# EAGLE design protoboard.rev01 (EAGLE 9.6.2)
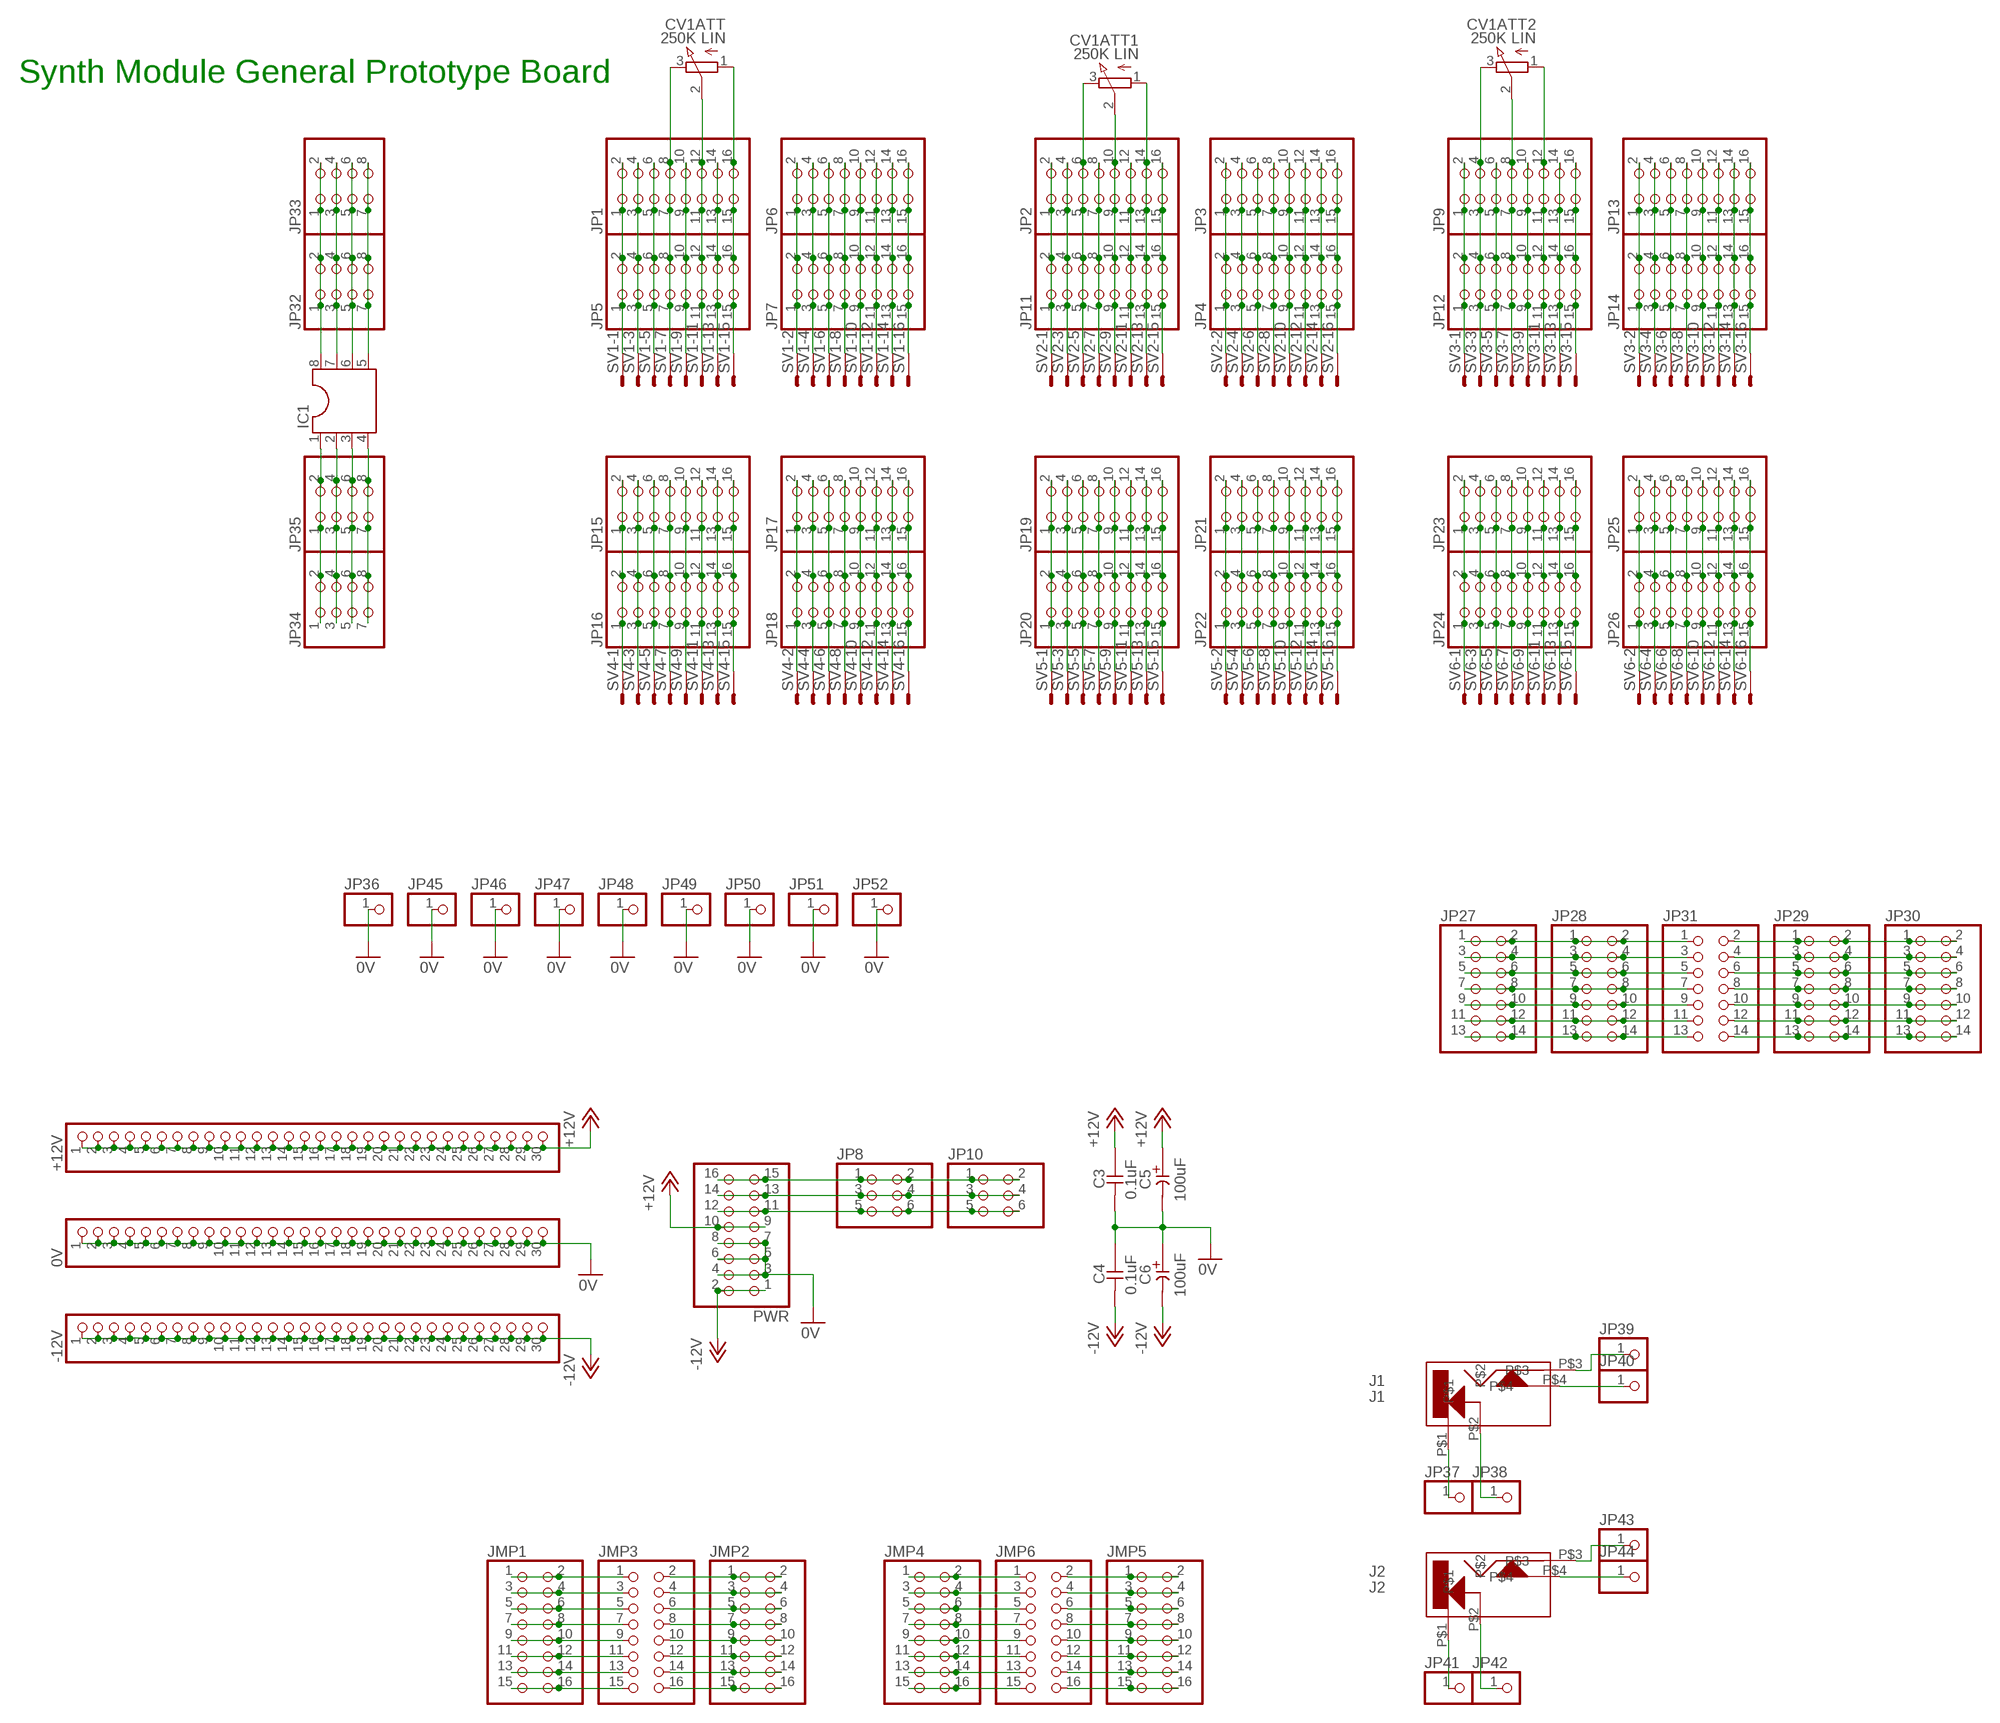
[diagram p0: schematic, sheet 1]

## Parts
0V  PINHD-1X30  [1X30]
+12V  PINHD-1X30  [1X30]
-12V  PINHD-1X30  [1X30]
C3  0.1uF  CC-US025-024X044  [C025-024X044]
C4  0.1uF  CC-US025-024X044  [C025-024X044]
C5  100uF  CE-USE5-8.5  [E5-8,5]
C6  100uF  CE-USE5-8.5  [E5-8,5]
CV1ATT  250K LIN  3RP/1610N  [3RP/1610N]
CV1ATT1  250K LIN  3RP/1610N  [3RP/1610N]
CV1ATT2  250K LIN  3RP/1610N  [3RP/1610N]
IC1  DIL8S  [SOCKET-08]
J1  J1  CL1384  [CL1384]
J2  J2  CL1384  [CL1384]
JMP1  PINHD-2X8  [2X08]
JMP2  PINHD-2X8  [2X08]
JMP3  PINHD-2X8  [2X08]
JMP4  PINHD-2X8  [2X08]
JMP5  PINHD-2X8  [2X08]
JMP6  PINHD-2X8  [2X08]
JP1  PINHD-2X8  [2X08]
JP2  PINHD-2X8  [2X08]
JP3  PINHD-2X8  [2X08]
JP4  PINHD-2X8  [2X08]
JP5  PINHD-2X8  [2X08]
JP6  PINHD-2X8  [2X08]
JP7  PINHD-2X8  [2X08]
JP8  PINHD-2X3  [2X03]
JP9  PINHD-2X8  [2X08]
JP10  PINHD-2X3  [2X03]
JP11  PINHD-2X8  [2X08]
JP12  PINHD-2X8  [2X08]
JP13  PINHD-2X8  [2X08]
JP14  PINHD-2X8  [2X08]
JP15  PINHD-2X8  [2X08]
JP16  PINHD-2X8  [2X08]
JP17  PINHD-2X8  [2X08]
JP18  PINHD-2X8  [2X08]
JP19  PINHD-2X8  [2X08]
JP20  PINHD-2X8  [2X08]
JP21  PINHD-2X8  [2X08]
JP22  PINHD-2X8  [2X08]
JP23  PINHD-2X8  [2X08]
JP24  PINHD-2X8  [2X08]
JP25  PINHD-2X8  [2X08]
JP26  PINHD-2X8  [2X08]
JP27  PINHD-2X7  [2X07]
JP28  PINHD-2X7  [2X07]
JP29  PINHD-2X7  [2X07]
JP30  PINHD-2X7  [2X07]
JP31  PINHD-2X7  [2X07]
JP32  PINHD-2X4  [2X04]
JP33  PINHD-2X4  [2X04]
JP34  PINHD-2X4  [2X04]
JP35  PINHD-2X4  [2X04]
JP36  PINHD-1X1  [1X01]
JP37  PINHD-1X1  [1X01]
JP38  PINHD-1X1  [1X01]
JP39  PINHD-1X1  [1X01]
JP40  PINHD-1X1  [1X01]
JP41  PINHD-1X1  [1X01]
JP42  PINHD-1X1  [1X01]
JP43  PINHD-1X1  [1X01]
JP44  PINHD-1X1  [1X01]
JP45  PINHD-1X1  [1X01]
JP46  PINHD-1X1  [1X01]
JP47  PINHD-1X1  [1X01]
JP48  PINHD-1X1  [1X01]
JP49  PINHD-1X1  [1X01]
JP50  PINHD-1X1  [1X01]
JP51  PINHD-1X1  [1X01]
JP52  PINHD-1X1  [1X01]
PWR  PINHD-2X8  [2X08]
SV1  16E  [16P]
SV2  16E  [16P]
SV3  16E  [16P]
SV4  16E  [16P]
SV5  16E  [16P]
SV6  16E  [16P]

## Nets
0V [pwr]: 0V.1 0V.2 0V.3 0V.4 0V.5 0V.6 0V.7 0V.8 0V.9 0V.10 0V.11 0V.12 0V.13 0V.14 0V.15 0V.16 0V.17 0V.18 0V.19 0V.20 0V.21 0V.22 0V.23 0V.24 0V.25 0V.26 0V.27 0V.28 0V.29 0V.30 C3.2 C4.1 C5.- C6.+ JP36.1 JP45.1 JP46.1 JP47.1 JP48.1 JP49.1 JP50.1 JP51.1 JP52.1 PWR.3 PWR.4 PWR.5 PWR.6 PWR.7 PWR.8
+12V [pwr]: +12V.1 +12V.2 +12V.3 +12V.4 +12V.5 +12V.6 +12V.7 +12V.8 +12V.9 +12V.10 +12V.11 +12V.12 +12V.13 +12V.14 +12V.15 +12V.16 +12V.17 +12V.18 +12V.19 +12V.20 +12V.21 +12V.22 +12V.23 +12V.24 +12V.25 +12V.26 +12V.27 +12V.28 +12V.29 +12V.30 C3.1 C5.+ PWR.9 PWR.10
-12V [pwr]: -12V.1 -12V.2 -12V.3 -12V.4 -12V.5 -12V.6 -12V.7 -12V.8 -12V.9 -12V.10 -12V.11 -12V.12 -12V.13 -12V.14 -12V.15 -12V.16 -12V.17 -12V.18 -12V.19 -12V.20 -12V.21 -12V.22 -12V.23 -12V.24 -12V.25 -12V.26 -12V.27 -12V.28 -12V.29 -12V.30 C4.2 C6.- PWR.1 PWR.2
N$1: JP2.1 JP2.2 JP11.1 JP11.2 SV2.1
N$2: JP3.1 JP3.2 JP4.1 JP4.2 SV2.2
N$3: JP2.3 JP2.4 JP11.3 JP11.4 SV2.3
N$4: CV1ATT1.3(E) JP2.5 JP2.6 JP11.5 JP11.6 SV2.5
N$5: JP2.7 JP2.8 JP11.7 JP11.8 SV2.7
N$6: CV1ATT1.2(S) JP2.9 JP2.10 JP11.9 JP11.10 SV2.9
N$7: JP2.11 JP2.12 JP11.11 JP11.12 SV2.11
N$8: CV1ATT1.1(A) JP2.13 JP2.14 JP11.13 JP11.14 SV2.13
N$9: JP3.3 JP3.4 JP4.3 JP4.4 SV2.4
N$10: JP3.5 JP3.6 JP4.5 JP4.6 SV2.6
N$11: JP3.7 JP3.8 JP4.7 JP4.8 SV2.8
N$12: JP3.9 JP3.10 JP4.9 JP4.10 SV2.10
N$13: JP3.11 JP3.12 JP4.11 JP4.12 SV2.12
N$14: JP3.13 JP3.14 JP4.13 JP4.14 SV2.14
N$15: JP3.15 JP3.16 JP4.15 JP4.16 SV2.16
N$16: JP1.1 JP1.2 JP5.1 JP5.2 SV1.1
N$17: JP1.3 JP1.4 JP5.3 JP5.4 SV1.3
N$18: JP1.5 JP1.6 JP5.5 JP5.6 SV1.5
N$19: CV1ATT.3(E) JP1.7 JP1.8 JP5.7 JP5.8 SV1.7
N$20: JP1.9 JP1.10 JP5.9 JP5.10 SV1.9
N$24: CV1ATT.2(S) JP1.11 JP1.12 JP5.11 JP5.12 SV1.11
N$25: JP1.13 JP1.14 JP5.13 JP5.14 SV1.13
N$26: CV1ATT.1(A) JP1.15 JP1.16 JP5.15 JP5.16 SV1.15
N$27: JP6.1 JP6.2 JP7.1 JP7.2 SV1.2
N$28: JP6.3 JP6.4 JP7.3 JP7.4 SV1.4
N$29: JP6.5 JP6.6 JP7.5 JP7.6 SV1.6
N$30: JP6.7 JP6.8 JP7.7 JP7.8 SV1.8
N$31: JP6.9 JP6.10 JP7.9 JP7.10 SV1.10
N$32: JP6.11 JP6.12 JP7.11 JP7.12 SV1.12
N$33: JP2.15 JP2.16 JP11.15 JP11.16 SV2.15
N$34: JP6.13 JP6.14 JP7.13 JP7.14 SV1.14
N$35: JP6.15 JP6.16 JP7.15 JP7.16 SV1.16
N$36: JP9.1 JP9.2 JP12.1 JP12.2 SV3.1
N$37: CV1ATT2.3(E) JP9.3 JP9.4 JP12.3 JP12.4 SV3.3
N$38: JP9.5 JP9.6 JP12.5 JP12.6 SV3.5
N$39: CV1ATT2.2(S) JP9.7 JP9.8 JP12.7 JP12.8 SV3.7
N$40: JP9.9 JP9.10 JP12.9 JP12.10 SV3.9
N$41: CV1ATT2.1(A) JP9.11 JP9.12 JP12.11 JP12.12 SV3.11
N$42: JP9.13 JP9.14 JP12.13 JP12.14 SV3.13
N$43: JP9.15 JP9.16 JP12.15 JP12.16 SV3.15
N$44: JP13.1 JP13.2 JP14.1 JP14.2 SV3.2
N$45: JP13.3 JP13.4 JP14.3 JP14.4 SV3.4
N$46: JP13.5 JP13.6 JP14.5 JP14.6 SV3.6
N$47: JP13.7 JP13.8 JP14.7 JP14.8 SV3.8
N$48: JP13.9 JP13.10 JP14.9 JP14.10 SV3.10
N$49: JP13.11 JP13.12 JP14.11 JP14.12 SV3.12
N$50: JP13.13 JP13.14 JP14.13 JP14.14 SV3.14
N$51: JP13.15 JP13.16 JP14.15 JP14.16 SV3.16
N$52: JP15.1 JP15.2 JP16.1 JP16.2 SV4.1
N$53: JP15.3 JP15.4 JP16.3 JP16.4 SV4.3
N$54: JP15.5 JP15.6 JP16.5 JP16.6 SV4.5
N$55: JP15.7 JP15.8 JP16.7 JP16.8 SV4.7
N$56: JP15.9 JP15.10 JP16.9 JP16.10 SV4.9
N$57: JP15.11 JP15.12 JP16.11 JP16.12 SV4.11
N$58: JP15.13 JP15.14 JP16.13 JP16.14 SV4.13
N$59: JP15.15 JP15.16 JP16.15 JP16.16 SV4.15
N$60: JP17.1 JP17.2 JP18.1 JP18.2 SV4.2
N$61: JP17.3 JP17.4 JP18.3 JP18.4 SV4.4
N$62: JP17.5 JP17.6 JP18.5 JP18.6 SV4.6
N$63: JP17.7 JP17.8 JP18.7 JP18.8 SV4.8
N$64: JP17.9 JP17.10 JP18.9 JP18.10 SV4.10
N$65: JP17.11 JP17.12 JP18.11 JP18.12 SV4.12
N$66: JP17.13 JP17.14 JP18.13 JP18.14 SV4.14
N$67: JP17.15 JP17.16 JP18.15 JP18.16 SV4.16
N$68: JP19.1 JP19.2 JP20.1 JP20.2 SV5.1
N$69: JP19.3 JP19.4 JP20.3 JP20.4 SV5.3
N$70: JP19.5 JP19.6 JP20.5 JP20.6 SV5.5
N$71: JP19.7 JP19.8 JP20.7 JP20.8 SV5.7
N$72: JP19.9 JP19.10 JP20.9 JP20.10 SV5.9
N$73: JP19.11 JP19.12 JP20.11 JP20.12 SV5.11
N$74: JP19.13 JP19.14 JP20.13 JP20.14 SV5.13
N$75: JP19.15 JP19.16 JP20.15 JP20.16 SV5.15
N$76: JP21.1 JP21.2 JP22.1 JP22.2 SV5.2
N$77: JP21.3 JP21.4 JP22.3 JP22.4 SV5.4
N$78: JP21.5 JP21.6 JP22.5 JP22.6 SV5.6
N$79: JP21.7 JP21.8 JP22.7 JP22.8 SV5.8
N$80: JP21.9 JP21.10 JP22.9 JP22.10 SV5.10
N$81: JP21.11 JP21.12 JP22.11 JP22.12 SV5.12
N$82: JP21.13 JP21.14 JP22.13 JP22.14 SV5.14
N$83: JP21.15 JP21.16 JP22.15 JP22.16 SV5.16
N$84: JP23.1 JP23.2 JP24.1 JP24.2 SV6.1
N$85: JP23.3 JP23.4 JP24.3 JP24.4 SV6.3
N$86: JP23.5 JP23.6 JP24.5 JP24.6 SV6.5
N$87: JP23.7 JP23.8 JP24.7 JP24.8 SV6.7
N$88: JP23.9 JP23.10 JP24.9 JP24.10 SV6.9
N$89: JP23.11 JP23.12 JP24.11 JP24.12 SV6.11
N$90: JP23.13 JP23.14 JP24.13 JP24.14 SV6.13
N$91: JP23.15 JP23.16 JP24.15 JP24.16 SV6.15
N$92: JP25.1 JP25.2 JP26.1 JP26.2 SV6.2
N$93: JP25.3 JP25.4 JP26.3 JP26.4 SV6.4
N$94: JP25.5 JP25.6 JP26.5 JP26.6 SV6.6
N$95: JP25.7 JP25.8 JP26.7 JP26.8 SV6.8
N$96: JP25.9 JP25.10 JP26.9 JP26.10 SV6.10
N$97: JP25.11 JP25.12 JP26.11 JP26.12 SV6.12
N$98: JP25.13 JP25.14 JP26.13 JP26.14 SV6.14
N$99: JP25.15 JP25.16 JP26.15 JP26.16 SV6.16
N$100: J1.P$1 JP37.1
N$101: J1.P$2 JP38.1
N$102: J2.P$1 JP41.1
N$103: J2.P$2 JP42.1
N$104: JMP1.1 JMP1.2 JMP3.1
N$105: JMP1.3 JMP1.4 JMP3.3
N$106: JMP1.5 JMP1.6 JMP3.5
N$107: JMP1.7 JMP1.8 JMP3.7
N$108: JMP1.9 JMP1.10 JMP3.9
N$109: JMP1.11 JMP1.12 JMP3.11
N$110: JMP1.13 JMP1.14 JMP3.13
N$111: JMP1.15 JMP1.16 JMP3.15
N$112: JMP2.1 JMP2.2 JMP3.2
N$113: JMP2.3 JMP2.4 JMP3.4
N$114: JMP2.5 JMP2.6 JMP3.6
N$115: JMP2.7 JMP2.8 JMP3.8
N$116: JMP2.9 JMP2.10 JMP3.10
N$117: JMP2.11 JMP2.12 JMP3.12
N$118: JMP2.13 JMP2.14 JMP3.14
N$119: JMP2.15 JMP2.16 JMP3.16
N$120: JMP4.1 JMP4.2 JMP6.1
N$121: JMP4.3 JMP4.4 JMP6.3
N$122: JMP4.5 JMP4.6 JMP6.5
N$123: JMP4.7 JMP4.8 JMP6.7
N$124: JMP4.9 JMP4.10 JMP6.9
N$125: JMP4.11 JMP4.12 JMP6.11
N$126: JMP4.13 JMP4.14 JMP6.13
N$127: JMP4.15 JMP4.16 JMP6.15
N$128: JMP5.1 JMP5.2 JMP6.2
N$129: JMP5.3 JMP5.4 JMP6.4
N$130: JMP5.5 JMP5.6 JMP6.6
N$131: JMP5.7 JMP5.8 JMP6.8
N$132: JMP5.9 JMP5.10 JMP6.10
N$133: JMP5.11 JMP5.12 JMP6.12
N$134: JMP5.13 JMP5.14 JMP6.14
N$135: JMP5.15 JMP5.16 JMP6.16
N$136: JP27.1 JP27.2 JP28.1 JP28.2 JP31.1
N$137: JP27.3 JP27.4 JP28.3 JP28.4 JP31.3
N$138: JP27.5 JP27.6 JP28.5 JP28.6 JP31.5
N$139: JP27.7 JP27.8 JP28.7 JP28.8 JP31.7
N$140: JP27.9 JP27.10 JP28.9 JP28.10 JP31.9
N$141: JP27.11 JP27.12 JP28.11 JP28.12 JP31.11
N$142: JP27.13 JP27.14 JP28.13 JP28.14 JP31.13
N$143: IC1.8 JP32.1 JP32.2 JP33.1 JP33.2
N$144: IC1.7 JP32.3 JP32.4 JP33.3 JP33.4
N$145: IC1.6 JP32.5 JP32.6 JP33.5 JP33.6
N$146: IC1.5 JP32.7 JP32.8 JP33.7 JP33.8
N$147: J2.P$3 JP43.1
N$148: J2.P$4 JP44.1
N$149: J1.P$4 JP40.1
N$150: JP29.1 JP29.2 JP30.1 JP30.2 JP31.2
N$151: JP29.3 JP29.4 JP30.3 JP30.4 JP31.4
N$152: JP29.5 JP29.6 JP30.5 JP30.6 JP31.6
N$153: JP29.7 JP29.8 JP30.7 JP30.8 JP31.8
N$154: JP29.9 JP29.10 JP30.9 JP30.10 JP31.10
N$155: JP29.11 JP29.12 JP30.11 JP30.12 JP31.12
N$156: JP29.13 JP29.14 JP30.13 JP30.14 JP31.14
N$157: J1.P$3 JP39.1
N$158: IC1.1 JP34.1 JP34.2 JP35.1 JP35.2
N$159: IC1.2 JP34.3 JP34.4 JP35.3 JP35.4
N$160: IC1.3 JP34.5 JP34.6 JP35.5 JP35.6
N$161: IC1.4 JP34.7 JP34.8 JP35.7 JP35.8
N$165: JP8.5 JP8.6 JP10.5 JP10.6 PWR.11 PWR.12
N$166: JP8.1 JP8.2 JP10.1 JP10.2 PWR.15 PWR.16
N$169: JP8.3 JP8.4 JP10.3 JP10.4 PWR.13 PWR.14

## Notes on the sheet
- Synth Module General Prototype Board

## Library data of the parts
0V +12V -12V = pinhead:PINHD-1X30: PIN HEADER
C3 C4 = _common:CC-US: CAPACITOR, US symbol
C5 C6 = _common:CE-US: ELECTROLYTIC CAPACITOR, US symbol
CV1ATT CV1ATT1 CV1ATT2 = _common:3RP/1610N: Generic single level pcb pot.
IC1 = ic-package:DIL8: Dual In Line / Socket
J1 J2 = jacks:CL1384
JMP1-JMP6 JP1-JP7 JP9 JP11-JP26 PWR = pinhead:PINHD-2X8: PIN HEADER
JP8 JP10 = pinhead:PINHD-2X3: PIN HEADER
JP27-JP31 = pinhead:PINHD-2X7: PIN HEADER
JP32-JP35 = pinhead:PINHD-2X4: PIN HEADER
JP36-JP52 = pinhead:PINHD-1X1: PIN HEADER
SV1-SV6 = con-dil:16E: DIL CABLE CONNECTOR

## Net classes
0 default: width 0.406 mm, clearance 0.305 mm
1 pwr: width 0.813 mm, clearance 0.305 mm to class 0, clearance 0.305 mm

## Board
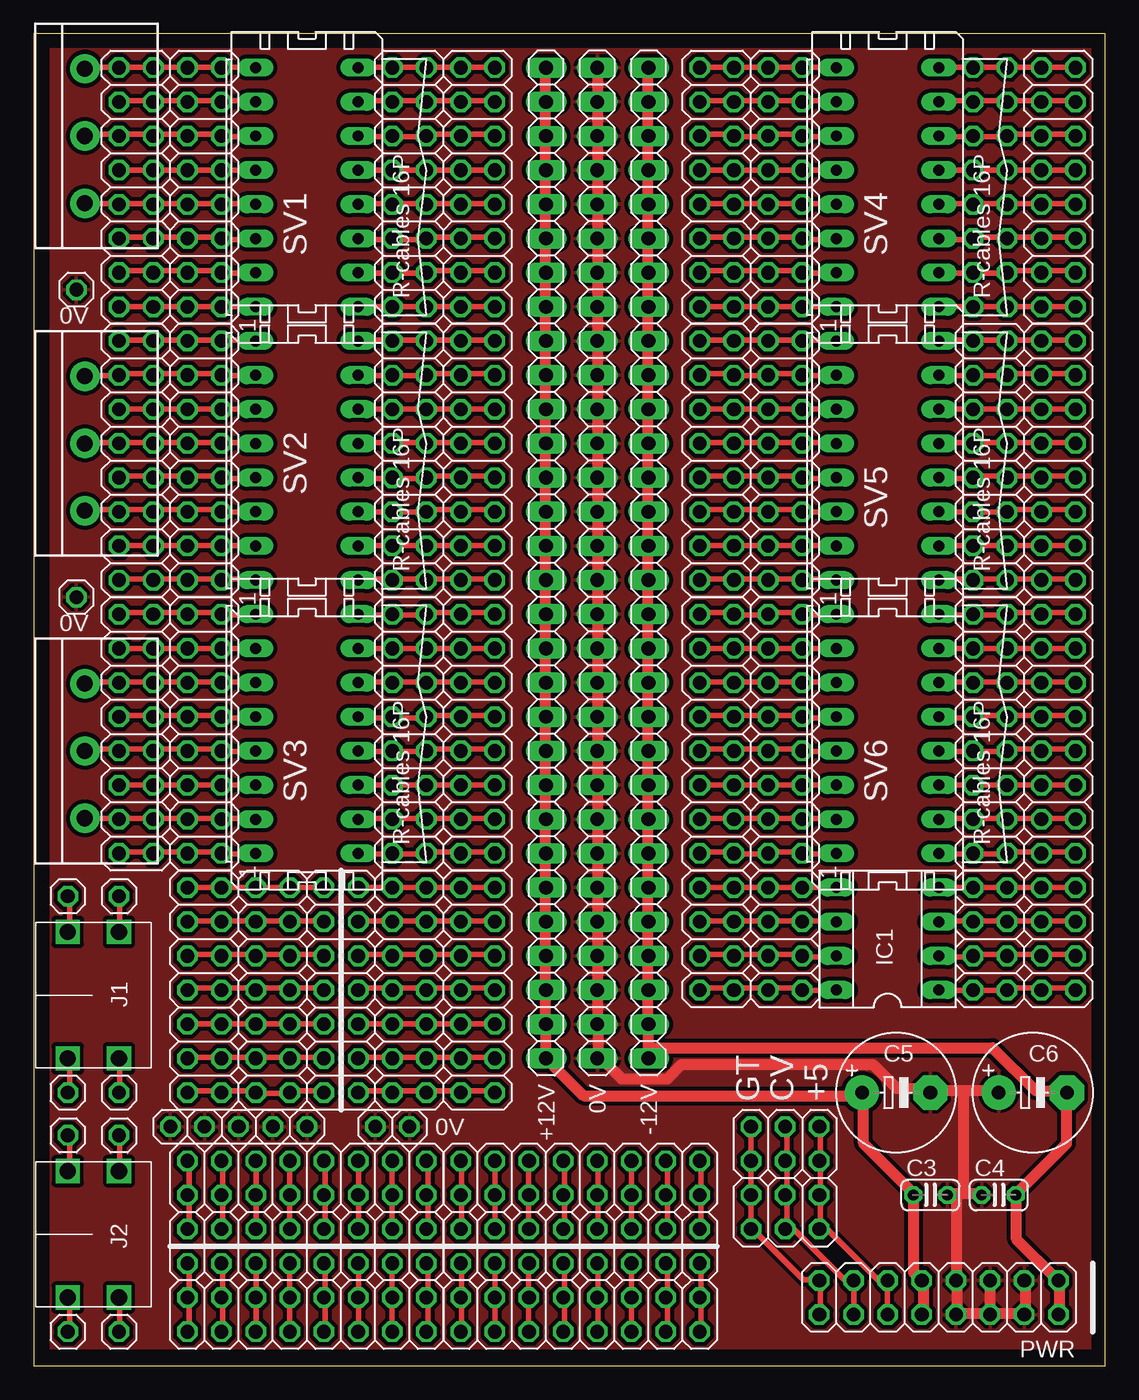
[diagram p1: board, top side]
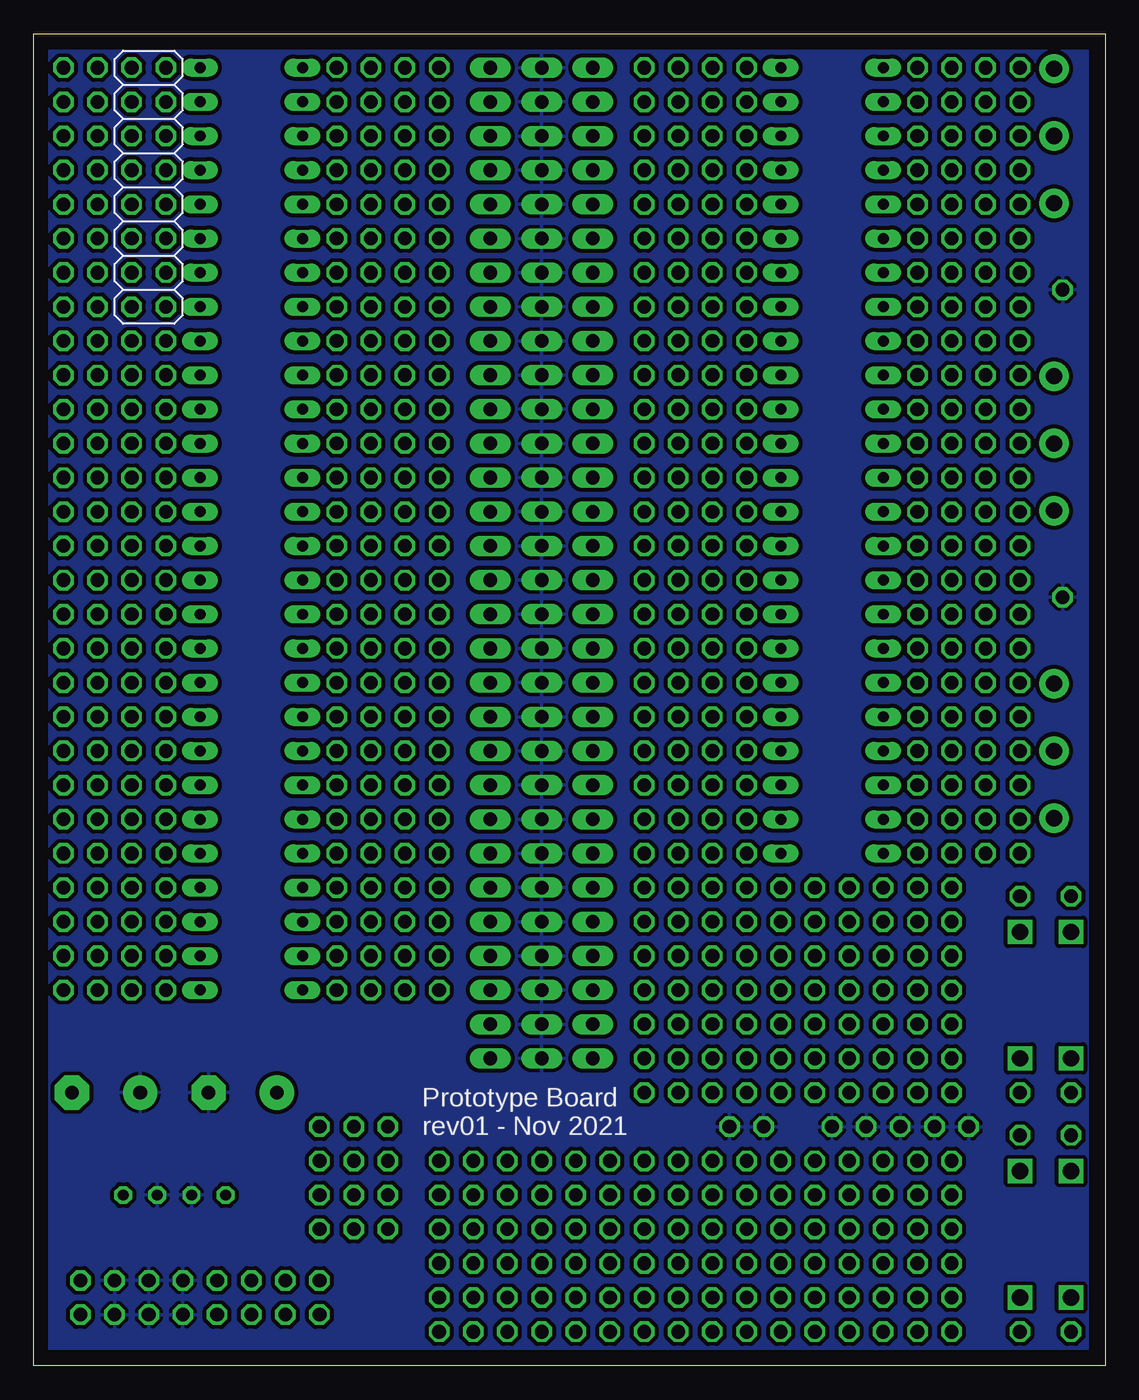
[diagram p2: board, bottom side, seen from below]

Size 79.68 x 99.05 mm. Coordinates in mm from the lower left corner, seen from the top.
Outline: 0,0 79.68,0 79.68,99.05 0,99.05 0,0
Copper layers (1*16): Top 0.035mm / dielectric 1.5mm / Bottom 0.035mm
Design rules "default": minimum track width 6mil, minimum drill 0.35mm, track to track 6mil, track to pad 6mil, pad to pad 6mil, via to via 6mil, smd to smd 6mil, copper to edge 40mil, drill to drill 6mil, minimum pad ring 10mil, minimum via ring 8mil, stop-mask expansion 4mil, vias tented up to drill 0mil, thermal gap 10mil

### Footprints (pad centres in the part's own frame; a part is rotated, then mirrored left to right if it is on the bottom)
1X30 = drill 1.016 long: 1 -36.83,0; 2 -34.29,0; 3 -31.75,0; 4 -29.21,0; 5 -26.67,0; 6 -24.13,0; 7 -21.59,0; 8 -19.05,0; 9 -16.51,0; 10 -13.97,0; 11 -11.43,0; 12 -8.89,0; 13 -6.35,0; 14 -3.81,0; 15 -1.27,0; 16 1.27,0; 17 3.81,0; 18 6.35,0; 19 8.89,0; 20 11.43,0; 21 13.97,0; 22 16.51,0; 23 19.05,0; 24 21.59,0; 25 24.13,0; 26 26.67,0; 27 29.21,0; 28 31.75,0; 29 34.29,0; 30 36.83,0
C025-024X044 = drill 0.813 octagon: 1 -1.27,0; 2 1.27,0
E5-8,5 = drill 1.016 pad 2.54: + -2.54,0 | drill 1.016 pad 2.54 octagon: - 2.54,0
3RP/1610N = drill 1.2 pad 2.184: 1 -5,0; 2 0,0; 3 5,0
SOCKET-08 = drill 0.813 long: 1 -3.81,-3.81; 2 -1.27,-3.81; 3 1.27,-3.81; 4 3.81,-3.81; 5 3.81,3.81; 6 1.27,3.81; 7 -1.27,3.81; 8 -3.81,3.81
CL1384 = drill 1.2 square: P$1 0,0; P$2 9.4,0; P$3 0,-3.8; P$4 9.4,-3.8
2X08 = drill 1.016 octagon: 1 -8.89,-1.27; 2 -8.89,1.27; 3 -6.35,-1.27; 4 -6.35,1.27; 5 -3.81,-1.27; 6 -3.81,1.27; 7 -1.27,-1.27; 8 -1.27,1.27; 9 1.27,-1.27; 10 1.27,1.27; 11 3.81,-1.27; 12 3.81,1.27; 13 6.35,-1.27; 14 6.35,1.27; 15 8.89,-1.27; 16 8.89,1.27
2X03 = drill 1.016 octagon: 1 -2.54,-1.27; 2 -2.54,1.27; 3 0,-1.27; 4 0,1.27; 5 2.54,-1.27; 6 2.54,1.27
2X07 = drill 1.016 octagon: 1 -7.62,-1.27; 2 -7.62,1.27; 3 -5.08,-1.27; 4 -5.08,1.27; 5 -2.54,-1.27; 6 -2.54,1.27; 7 0,-1.27; 8 0,1.27; 9 2.54,-1.27; 10 2.54,1.27; 11 5.08,-1.27; 12 5.08,1.27; 13 7.62,-1.27; 14 7.62,1.27
2X04 = drill 1.016 octagon: 1 -3.81,-1.27; 2 -3.81,1.27; 3 -1.27,-1.27; 4 -1.27,1.27; 5 1.27,-1.27; 6 1.27,1.27; 7 3.81,-1.27; 8 3.81,1.27
1X01 = drill 1.016 octagon: 1 0,0
16P = drill 0.813 long: 1 -8.89,3.81; 2 -8.89,-3.81; 3 -6.35,3.81; 4 -6.35,-3.81; 5 -3.81,3.81; 6 -3.81,-3.81; 7 -1.27,3.81; 8 -1.27,-3.81; 9 1.27,3.81; 10 1.27,-3.81; 11 3.81,3.81; 12 3.81,-3.81; 13 6.35,3.81; 14 6.35,-3.81; 15 8.89,3.81; 16 8.89,-3.81

### Placement (x,y rotation side)
0V  41.91,59.69 270 top
+12V  38.1,59.69 270 top
-12V  45.72,59.69 270 top
C3  66.67,12.7 0 top
C4  71.75,12.7 0 top
C5  64.14,20.32 0 top
C6  74.3,20.32 0 top
CV1ATT  3.81,91.44 270 top
CV1ATT1  3.81,68.58 270 top
CV1ATT2  3.81,45.72 270 top
IC1  63.5,31.75 90 top
J1  2.54,22.86 90 top
J2  2.54,5.08 90 top
JMP1  20.32,13.97 180 top
JMP2  20.32,3.81 180 top
JMP3  20.32,8.89 180 top
JMP4  40.64,13.97 180 top
JMP5  40.64,3.81 180 top
JMP6  40.64,8.89 180 top
JP1  12.7,87.63 90 top
JP2  12.7,67.31 90 top
JP3  27.94,67.31 90 top
JP4  33.02,67.31 90 top
JP5  7.62,87.63 90 top
JP6  27.94,87.63 90 top
JP7  33.02,87.63 90 top
JP8  55.88,11.43 0 top
JP9  12.7,46.99 90 top
JP10  55.88,16.51 0 top
JP11  7.62,67.31 90 top
JP12  7.62,46.99 90 top
JP13  27.94,46.99 90 top
JP14  33.02,46.99 90 top
JP15  55.88,87.63 90 top
JP16  50.8,87.63 90 top
JP17  76.2,87.63 90 top
JP18  71.12,87.63 90 bottom
JP19  55.88,67.31 90 top
JP20  50.8,67.31 90 top
JP21  71.12,67.31 90 top
JP22  76.2,67.31 90 top
JP23  55.88,46.99 90 top
JP24  50.8,46.99 90 top
JP25  71.12,46.99 90 top
JP26  76.2,46.99 90 top
JP27  33.02,27.94 90 top
JP28  27.94,27.94 90 top
JP29  12.7,27.94 90 top
JP30  17.78,27.94 90 top
JP31  22.86,27.94 90 top
JP32  55.88,31.75 90 top
JP33  50.8,31.75 90 top
JP34  71.12,31.75 90 top
JP35  76.2,31.75 90 top
JP36  3.17,80.01 0 top
JP37  2.54,20.32 0 top
JP38  2.54,34.92 0 top
JP39  6.35,20.32 0 top
JP40  6.35,34.92 0 top
JP41  2.54,2.54 0 top
JP42  2.54,17.14 0 top
JP43  6.35,2.54 0 top
JP44  6.35,17.14 0 top
JP45  3.17,57.15 0 top
JP46  10.16,17.78 0 top
JP47  12.7,17.78 0 top
JP48  15.24,17.78 0 top
JP49  17.78,17.78 0 top
JP50  20.32,17.78 0 top
JP51  25.4,17.78 0 top
JP52  27.94,17.78 0 top
PWR  67.31,5.08 180 top
SV1  20.32,87.63 90 top
SV2  20.32,67.31 90 top
SV3  20.32,46.99 90 top
SV4  63.5,87.63 90 top
SV5  63.5,67.31 90 top
SV6  63.5,46.99 90 top

### Tracks (layer width: path | path; a pad name or v marks a point on that pad's centre or on a via)
0V
  Top 0.813: 69.16,20.45 71.65,20.45 C6.+ | 69.16,20.45 66.67,20.45 C5.- 66.32,20.62 64.19,20.62 62.41,22.4 48.18,22.4 47.12,21.34 43.74,21.34 42.32,22.76 0V.30 41.96,22.94 41.96,25.25 0V.29 41.96,25.78 41.96,27.91 0V.28 41.96,28.27 41.96,30.4 0V.27 41.96,30.76 41.96,32.89 0V.26 41.96,33.43 41.96,35.56 0V.25 41.96,35.92 41.96,38.05 0V.24 41.96,38.41 41.96,40.54 0V.23 41.96,40.89 41.96,43.03 0V.22 41.96,43.56 41.96,45.7 0V.21 41.96,46.05 41.96,48.18 0V.20 41.96,48.54 41.96,50.67 0V.19 41.96,51.21 41.96,53.34 0V.18 41.96,53.7 41.96,55.83 0V.17 41.96,56.19 41.96,58.32 0V.16 41.96,58.67 41.96,60.81 0V.15 41.96,61.34 41.96,63.48 0V.14 41.96,63.83 41.96,65.96 0V.13 41.96,66.32 41.96,68.45 0V.12 41.96,68.99 41.96,71.12 0V.11 41.96,71.48 41.96,73.61 0V.10 41.96,73.97 41.96,76.1 0V.9 41.96,76.45 41.96,78.59 0V.8 41.96,79.12 41.96,81.25 0V.7 41.96,81.61 41.96,83.74 0V.6 41.96,84.1 41.96,86.23 0V.5 41.96,86.77 41.96,88.9 0V.4 41.96,89.26 41.96,91.39 0V.3 41.96,91.75 41.96,93.88 0V.2 41.96,94.23 41.96,96.37 0V.1 | 69.16,12.8 70.41,12.8 C4.1 | 69.16,12.8 68.63,12.8 | 68.63,12.8 68.1,12.8 C3.2 | PWR.6 71.12,3.91 68.99,3.91 PWR.8 68.63,3.91 68.63,6.22 PWR.7 68.63,6.76 68.63,12.8 | PWR.6 PWR.5 | PWR.6 71.48,3.91 73.61,3.91 PWR.4 73.79,4.27 73.79,6.22 PWR.3 | 69.16,12.8 69.16,20.45
  pour Bottom (isolate 0.305): 1.27,97.79 78.74,97.79 78.74,1.27 1.27,1.27
  pour Top (isolate 0.305): 1.27,98.42 78.74,98.42 78.74,1.27 1.27,1.27
+12V
  Top 0.813: PWR.10 66.14,3.91 66.14,6.04 PWR.9 65.96,6.4 65.43,6.93 65.43,12.62 C3.1 65.25,12.98 61.7,16.54 61.7,20.27 C5.+ 61.34,20.09 40.89,20.09 38.41,22.58 +12V.30 38.05,22.94 38.05,25.25 +12V.29 38.05,25.78 38.05,27.91 +12V.28 38.05,28.27 38.05,30.4 +12V.27 38.05,30.76 38.05,32.89 +12V.26 38.05,33.43 38.05,35.56 +12V.25 38.05,35.92 38.05,38.05 +12V.24 38.05,38.41 38.05,40.54 +12V.23 38.05,40.89 38.05,43.03 +12V.22 38.05,43.56 38.05,45.7 +12V.21 38.05,46.05 38.05,48.18 +12V.20 38.05,48.54 38.05,50.67 +12V.19 38.05,51.21 38.05,53.34 +12V.18 38.05,53.7 38.05,55.83 +12V.17 38.05,56.19 38.05,58.32 +12V.16 38.05,58.67 38.05,60.81 +12V.15 38.05,61.34 38.05,63.48 +12V.14 38.05,63.83 38.05,65.96 +12V.13 38.05,66.32 38.05,68.45 +12V.12 38.05,68.99 38.05,71.12 +12V.11 38.05,71.48 38.05,73.61 +12V.10 38.05,73.97 38.05,76.1 +12V.9 38.05,76.45 38.05,78.59 +12V.8 38.05,79.12 38.05,81.25 +12V.7 38.05,81.61 38.05,83.74 +12V.6 38.05,84.1 38.05,86.23 +12V.5 38.05,86.77 38.05,88.9 +12V.4 38.05,89.26 38.05,91.39 +12V.3 38.05,91.75 38.05,93.88 +12V.2 38.05,94.23 38.05,96.37 +12V.1
-12V
  Top 0.813: PWR.2 76.28,3.91 76.28,6.04 PWR.1 76.1,6.4 73.08,9.42 73.08,12.62 C4.2 73.25,12.98 76.81,16.54 76.81,20.27 C6.- 76.45,20.45 74.5,20.45 71.3,23.65 45.7,23.65 | 45.7,23.65 45.7,25.25 -12V.29 45.7,25.78 45.7,27.91 -12V.28 45.7,28.27 45.7,30.4 -12V.27 45.7,30.76 45.7,32.89 -12V.26 45.7,33.43 45.7,35.56 -12V.25 45.7,35.92 45.7,38.05 -12V.24 45.7,38.41 45.7,40.54 -12V.23 45.7,40.89 45.7,43.03 -12V.22 45.7,43.56 45.7,45.7 -12V.21 45.7,46.05 45.7,48.18 -12V.20 45.7,48.54 45.7,50.67 -12V.19 45.7,51.21 45.7,53.34 -12V.18 45.7,53.7 45.7,55.83 -12V.17 45.7,56.19 45.7,58.32 -12V.16 45.7,58.67 45.7,60.81 -12V.15 45.7,61.34 45.7,63.48 -12V.14 45.7,63.83 45.7,65.96 -12V.13 45.7,66.32 45.7,68.45 -12V.12 45.7,68.99 45.7,71.12 -12V.11 45.7,71.48 45.7,73.61 -12V.10 45.7,73.97 45.7,76.1 -12V.9 45.7,76.45 45.7,78.59 -12V.8 45.7,79.12 45.7,81.25 -12V.7 45.7,81.61 45.7,83.74 -12V.6 45.7,84.1 45.7,86.23 -12V.5 45.7,86.77 45.7,88.9 -12V.4 45.7,89.26 45.7,91.39 -12V.3 45.7,91.75 45.7,93.88 -12V.2 45.7,94.23 45.7,96.37 -12V.1 | 45.7,23.65 45.7,22.94 -12V.30
N$1
  Top 0.406: JP11.2 6.4,58.5 8.89,58.5 JP11.1 9.07,58.5 11.38,58.5 JP2.2 11.56,58.5 13.87,58.5 JP2.1 14.05,58.5 16.36,58.5 SV2.1
N$2
  Top 0.406: SV2.2 24.18,58.5 26.67,58.5 JP3.2 26.85,58.5 29.16,58.5 JP3.1 29.34,58.5 31.65,58.5 JP4.2 31.83,58.5 34.14,58.5 JP4.1
N$3
  Top 0.406: JP11.4 6.4,60.98 8.89,60.98 JP11.3 9.07,60.98 11.38,60.98 JP2.4 11.56,60.98 13.87,60.98 JP2.3 14.05,60.98 16.36,60.98 SV2.3
N$4
  Top 0.406: SV2.5 16.36,63.48 14.05,63.48 JP2.5 13.87,63.65 11.56,63.65 JP2.6 11.38,63.65 9.07,63.65 JP11.5 8.89,63.65 6.4,63.65 JP11.6 6.22,63.65 3.91,63.65 CV1ATT1.3
N$5
  Top 0.406: JP11.8 6.4,66.14 8.89,66.14 JP11.7 9.07,66.14 11.38,66.14 JP2.8 11.56,66.14 13.87,66.14 JP2.7 14.05,65.96 16.36,65.96 SV2.7
N$6
  Top 0.406: SV2.9 16.36,68.63 14.05,68.63 JP2.9 13.87,68.63 11.56,68.63 JP2.10 11.38,68.63 9.07,68.63 JP11.9 8.89,68.63 6.4,68.63 JP11.10 6.22,68.63 3.91,68.63 CV1ATT1.2
N$7
  Top 0.406: JP11.12 JP11.11 JP2.12 JP2.11 SV2.11
N$8
  Top 0.406: SV2.13 16.36,73.61 14.05,73.61 JP2.13 13.87,73.79 11.56,73.79 JP2.14 11.38,73.79 9.07,73.79 JP11.13 8.89,73.79 6.4,73.79 JP11.14 6.22,73.61 3.91,73.61 CV1ATT1.1
N$9
  Top 0.406: SV2.4 24.18,60.98 26.67,60.98 JP3.4 26.85,60.98 29.16,60.98 JP3.3 29.34,60.98 31.65,60.98 JP4.4 31.83,60.98 34.14,60.98 JP4.3
N$10
  Top 0.406: SV2.6 24.18,63.48 26.67,63.48 JP3.6 26.85,63.48 29.16,63.48 JP3.5 29.34,63.65 31.65,63.65 JP4.6 31.83,63.65 34.14,63.65 JP4.5
N$11
  Top 0.406: SV2.8 24.18,65.96 26.67,65.96 JP3.8 26.85,65.96 29.16,65.96 JP3.7 29.34,66.14 31.65,66.14 JP4.8 31.83,66.14 34.14,66.14 JP4.7
N$12
  Top 0.406: SV2.10 24.18,68.63 26.67,68.63 JP3.10 26.85,68.63 29.16,68.63 JP3.9 29.34,68.63 31.65,68.63 JP4.10 31.83,68.63 34.14,68.63 JP4.9
N$13
  Top 0.406: SV2.12 JP3.12 JP3.11 JP4.12 JP4.11
N$14
  Top 0.406: SV2.14 24.18,73.61 26.67,73.61 JP3.14 26.85,73.61 29.16,73.61 JP3.13 29.34,73.79 31.65,73.79 JP4.14 31.83,73.79 34.14,73.79 JP4.13
N$15
  Top 0.406: SV2.16 24.18,76.28 26.67,76.28 JP3.16 26.85,76.28 29.16,76.28 JP3.15 29.34,76.28 31.65,76.28 JP4.16 31.83,76.28 34.14,76.28 JP4.15
N$16
  Top 0.406: JP5.2 6.4,78.77 8.89,78.77 JP5.1 9.07,78.77 11.38,78.77 JP1.2 11.56,78.77 13.87,78.77 JP1.1 14.05,78.77 16.36,78.77 SV1.1
N$17
  Top 0.406: JP5.4 6.4,81.43 8.89,81.43 JP5.3 9.07,81.43 11.38,81.43 JP1.4 11.56,81.43 13.87,81.43 JP1.3 14.05,81.25 16.36,81.25 SV1.3
N$18
  Top 0.406: JP5.6 6.4,83.92 8.89,83.92 JP5.5 9.07,83.92 11.38,83.92 JP1.6 11.56,83.92 13.87,83.92 JP1.5 14.05,83.74 16.36,83.74 SV1.5
N$19
  Top 0.406: SV1.7 16.36,86.41 14.05,86.41 JP1.7 13.87,86.41 11.56,86.41 JP1.8 11.38,86.41 9.07,86.41 JP5.7 8.89,86.41 6.4,86.41 JP5.8 6.22,86.41 3.91,86.41 CV1ATT.3
N$20
  Top 0.406: JP5.10 JP5.9 JP1.10 JP1.9 SV1.9
N$24
  Top 0.406: SV1.11 16.36,91.39 14.05,91.39 JP1.11 13.87,91.57 11.56,91.57 JP1.12 11.38,91.57 9.07,91.57 JP5.11 8.89,91.57 6.4,91.57 JP5.12 6.22,91.57 3.91,91.57 CV1ATT.2
N$25
  Top 0.406: JP5.14 6.4,94.06 8.89,94.06 JP5.13 9.07,94.06 11.38,94.06 JP1.14 11.56,94.06 13.87,94.06 JP1.13 14.05,94.06 16.36,94.06 SV1.13
N$26
  Top 0.406: SV1.15 16.36,96.55 14.05,96.55 JP1.15 13.87,96.55 11.56,96.55 JP1.16 11.38,96.55 9.07,96.55 JP5.15 8.89,96.55 6.4,96.55 JP5.16 6.22,96.55 3.91,96.55 CV1ATT.1
N$27
  Top 0.406: SV1.2 24.18,78.77 26.67,78.77 JP6.2 26.85,78.77 29.16,78.77 JP6.1 29.34,78.77 31.65,78.77 JP7.2 31.83,78.77 34.14,78.77 JP7.1
N$28
  Top 0.406: SV1.4 24.18,81.25 26.67,81.25 JP6.4 26.85,81.25 29.16,81.25 JP6.3 29.34,81.43 31.65,81.43 JP7.4 31.83,81.43 34.14,81.43 JP7.3
N$29
  Top 0.406: SV1.6 24.18,83.74 26.67,83.74 JP6.6 26.85,83.74 29.16,83.74 JP6.5 29.34,83.92 31.65,83.92 JP7.6 31.83,83.92 34.14,83.92 JP7.5
N$30
  Top 0.406: SV1.8 24.18,86.41 26.67,86.41 JP6.8 26.85,86.41 29.16,86.41 JP6.7 29.34,86.41 31.65,86.41 JP7.8 31.83,86.41 34.14,86.41 JP7.7
N$31
  Top 0.406: SV1.10 JP6.10 JP6.9 JP7.10 JP7.9
N$32
  Top 0.406: SV1.12 24.18,91.39 26.67,91.39 JP6.12 26.85,91.39 29.16,91.39 JP6.11 29.34,91.57 31.65,91.57 JP7.12 31.83,91.57 34.14,91.57 JP7.11
N$33
  Top 0.406: JP11.16 6.4,76.28 8.89,76.28 JP11.15 9.07,76.28 11.38,76.28 JP2.16 11.56,76.28 13.87,76.28 JP2.15 14.05,76.28 16.36,76.28 SV2.15
N$34
  Top 0.406: SV1.14 24.18,94.06 26.67,94.06 JP6.14 26.85,94.06 29.16,94.06 JP6.13 29.34,94.06 31.65,94.06 JP7.14 31.83,94.06 34.14,94.06 JP7.13
N$35
  Top 0.406: SV1.16 24.18,96.55 26.67,96.55 JP6.16 26.85,96.55 29.16,96.55 JP6.15 29.34,96.55 31.65,96.55 JP7.16 31.83,96.55 34.14,96.55 JP7.15
N$36
  Top 0.406: JP12.2 6.4,38.23 8.89,38.23 JP12.1 9.07,38.23 11.38,38.23 JP9.2 11.56,38.23 13.87,38.23 JP9.1 14.05,38.05 16.36,38.05 SV3.1
N$37
  Top 0.406: SV3.3 16.36,40.72 14.05,40.72 JP9.3 13.87,40.72 11.56,40.72 JP9.4 11.38,40.72 9.07,40.72 JP12.3 8.89,40.72 6.4,40.72 JP12.4 6.22,40.72 3.91,40.72 CV1ATT2.3
N$38
  Top 0.406: JP12.6 6.4,43.2 8.89,43.2 JP12.5 9.07,43.2 11.38,43.2 JP9.6 11.56,43.2 13.87,43.2 JP9.5 14.05,43.2 16.36,43.2 SV3.5
N$39
  Top 0.406: SV3.7 16.36,45.7 14.05,45.7 JP9.7 13.87,45.87 11.56,45.87 JP9.8 11.38,45.87 9.07,45.87 JP12.7 8.89,45.87 6.4,45.87 JP12.8 6.22,45.87 3.91,45.87 CV1ATT2.2
N$40
  Top 0.406: JP12.10 6.4,48.36 8.89,48.36 JP12.9 9.07,48.36 11.38,48.36 JP9.10 11.56,48.36 13.87,48.36 JP9.9 14.05,48.18 16.36,48.18 SV3.9
N$41
  Top 0.406: SV3.11 16.36,50.85 14.05,50.85 JP9.11 13.87,50.85 11.56,50.85 JP9.12 11.38,50.85 9.07,50.85 JP12.11 8.89,50.85 6.4,50.85 JP12.12 6.22,50.85 3.91,50.85 CV1ATT2.1
N$42
  Top 0.406: JP12.14 JP12.13 JP9.14 JP9.13 SV3.13
N$43
  Top 0.406: JP12.16 6.4,56.01 8.89,56.01 JP12.15 9.07,56.01 11.38,56.01 JP9.16 11.56,56.01 13.87,56.01 JP9.15 14.05,55.83 16.36,55.83 SV3.15
N$44
  Top 0.406: SV3.2 24.18,38.05 26.67,38.05 JP13.2 26.85,38.05 29.16,38.05 JP13.1 29.34,38.23 31.65,38.23 JP14.2 31.83,38.23 34.14,38.23 JP14.1
N$45
  Top 0.406: SV3.4 24.18,40.72 26.67,40.72 JP13.4 26.85,40.72 29.16,40.72 JP13.3 29.34,40.72 31.65,40.72 JP14.4 31.83,40.72 34.14,40.72 JP14.3
N$46
  Top 0.406: SV3.6 24.18,43.2 26.67,43.2 JP13.6 26.85,43.2 29.16,43.2 JP13.5 29.34,43.2 31.65,43.2 JP14.6 31.83,43.2 34.14,43.2 JP14.5
N$47
  Top 0.406: SV3.8 24.18,45.7 26.67,45.7 JP13.8 26.85,45.7 29.16,45.7 JP13.7 29.34,45.87 31.65,45.87 JP14.8 31.83,45.87 34.14,45.87 JP14.7
N$48
  Top 0.406: SV3.10 24.18,48.18 26.67,48.18 JP13.10 26.85,48.18 29.16,48.18 JP13.9 29.34,48.36 31.65,48.36 JP14.10 31.83,48.36 34.14,48.36 JP14.9
N$49
  Top 0.406: SV3.12 24.18,50.85 26.67,50.85 JP13.12 26.85,50.85 29.16,50.85 JP13.11 29.34,50.85 31.65,50.85 JP14.12 31.83,50.85 34.14,50.85 JP14.11
N$50
  Top 0.406: SV3.14 JP13.14 JP13.13 JP14.14 JP14.13
N$51
  Top 0.406: SV3.16 24.18,55.83 26.67,55.83 JP13.16 26.85,55.83 29.16,55.83 JP13.15 29.34,56.01 31.65,56.01 JP14.16 31.83,56.01 34.14,56.01 JP14.15
N$52
  Top 0.406: SV4.1 59.56,78.77 57.25,78.77 JP15.1 57.07,78.77 54.76,78.77 JP15.2 54.59,78.77 52.27,78.77 JP16.1 51.92,78.77 49.61,78.77 JP16.2
N$53
  Top 0.406: JP16.4 49.61,81.43 51.92,81.43 JP16.3 52.09,81.43 54.59,81.43 JP15.4 54.76,81.43 57.07,81.43 JP15.3 57.25,81.25 59.56,81.25 SV4.3
N$54
  Top 0.406: JP16.6 49.61,83.92 51.92,83.92 JP16.5 52.09,83.92 54.59,83.92 JP15.6 54.76,83.92 57.07,83.92 JP15.5 57.25,83.74 59.56,83.74 SV4.5
N$55
  Top 0.406: JP16.8 49.61,86.41 51.92,86.41 JP16.7 52.09,86.41 54.59,86.41 JP15.8 54.76,86.41 57.07,86.41 JP15.7 57.25,86.41 59.56,86.41 SV4.7
N$56
  Top 0.406: JP16.10 JP16.9 JP15.10 JP15.9 SV4.9
N$57
  Top 0.406: JP16.12 49.61,91.57 51.92,91.57 JP16.11 52.27,91.39 54.41,91.39 JP15.12 54.76,91.57 57.07,91.57 JP15.11 57.25,91.39 59.56,91.39 SV4.11
N$58
  Top 0.406: JP16.14 49.61,94.06 51.92,94.06 JP16.13 52.09,94.06 54.59,94.06 JP15.14 54.76,94.06 57.07,94.06 JP15.13 57.25,94.06 59.56,94.06 SV4.13
N$59
  Top 0.406: SV4.15 59.56,96.55 57.25,96.55 JP15.15 57.07,96.55 54.76,96.55 JP15.16 54.59,96.55 52.27,96.55 JP16.15 51.92,96.55 49.61,96.55 JP16.16
N$60
  Top 0.406: JP17.1 77.34,78.77 75.03,78.77 JP17.2 74.85,78.77 72.54,78.77 JP18.2 72.36,78.77 70.05,78.77 JP18.1 69.7,78.77 67.39,78.77 SV4.2
N$61
  Top 0.406: SV4.4 67.39,81.25 69.7,81.25 JP18.3 70.05,81.25 72.36,81.25 JP18.4 72.54,81.43 74.85,81.43 JP17.4 75.03,81.43 77.34,81.43 JP17.3
N$62
  Top 0.406: SV4.6 67.39,83.74 69.7,83.74 JP18.5 69.88,83.92 72.36,83.92 JP18.6 72.54,83.92 74.85,83.92 JP17.6 75.03,83.92 77.34,83.92 JP17.5
N$63
  Top 0.406: SV4.8 67.39,86.41 69.7,86.41 JP18.7 69.88,86.41 72.36,86.41 JP18.8 72.54,86.41 74.85,86.41 JP17.8 75.03,86.41 77.34,86.41 JP17.7
N$64
  Top 0.406: SV4.10 JP18.9 JP18.10 JP17.10 JP17.9
N$65
  Top 0.406: SV4.12 67.39,91.39 69.7,91.39 JP18.11 69.88,91.39 72.19,91.39 JP18.12 72.54,91.57 74.85,91.57 JP17.12 75.03,91.57 77.34,91.57 JP17.11
N$66
  Top 0.406: SV4.14 67.39,94.06 69.7,94.06 JP18.13 69.88,94.06 72.36,94.06 JP18.14 72.54,94.06 74.85,94.06 JP17.14 75.03,94.06 77.34,94.06 JP17.13
N$67
  Top 0.406: JP17.15 77.34,96.55 75.03,96.55 JP17.16 74.85,96.55 72.54,96.55 JP18.16 72.36,96.55 70.05,96.55 JP18.15 69.7,96.55 67.39,96.55 SV4.16
N$68
  Top 0.406: JP20.2 49.61,58.5 51.92,58.5 JP20.1 52.09,58.5 54.59,58.5 JP19.2 54.76,58.5 57.07,58.5 JP19.1 57.25,58.5 59.56,58.5 SV5.1
N$69
  Top 0.406: SV5.3 59.56,60.98 57.25,60.98 JP19.3 57.07,60.98 54.76,60.98 JP19.4 54.59,60.98 52.27,60.98 JP20.3 51.92,60.98 49.61,60.98 JP20.4
N$70
  Top 0.406: JP20.6 49.61,63.65 51.92,63.65 JP20.5 52.09,63.65 54.59,63.65 JP19.6 54.76,63.65 57.07,63.65 JP19.5 57.25,63.48 59.56,63.48 SV5.5
N$71
  Top 0.406: JP20.8 49.61,66.14 51.92,66.14 JP20.7 52.09,66.14 54.59,66.14 JP19.8 54.76,66.14 57.07,66.14 JP19.7 57.25,65.96 59.56,65.96 SV5.7
N$72
  Top 0.406: JP20.10 49.61,68.63 51.92,68.63 JP20.9 52.09,68.63 54.59,68.63 JP19.10 54.76,68.63 57.07,68.63 JP19.9 57.25,68.63 59.56,68.63 SV5.9
N$73
  Top 0.406: JP20.12 JP20.11 JP19.12 JP19.11 SV5.11
N$74
  Top 0.406: JP20.14 49.61,73.79 51.92,73.79 JP20.13 52.27,73.61 54.41,73.61 JP19.14 54.76,73.79 57.07,73.79 JP19.13 57.25,73.61 59.56,73.61 SV5.13
N$75
  Top 0.406: JP20.16 49.61,76.28 51.92,76.28 JP20.15 52.09,76.28 54.59,76.28 JP19.16 54.76,76.28 57.07,76.28 JP19.15 57.25,76.28 59.56,76.28 SV5.15
N$76
  Top 0.406: SV5.2 67.39,58.5 69.7,58.5 JP21.2 69.88,58.5 72.36,58.5 JP21.1 72.54,58.5 74.85,58.5 JP22.2 75.03,58.5 77.34,58.5 JP22.1
N$77
  Top 0.406: JP22.3 77.34,60.98 75.03,60.98 JP22.4 74.85,60.98 72.54,60.98 JP21.3 72.36,60.98 70.05,60.98 JP21.4 69.7,60.98 67.39,60.98 SV5.4
N$78
  Top 0.406: SV5.6 67.39,63.48 69.7,63.48 JP21.6 70.05,63.48 72.36,63.48 JP21.5 72.54,63.65 74.85,63.65 JP22.6 75.03,63.65 77.34,63.65 JP22.5
N$79
  Top 0.406: SV5.8 67.39,65.96 69.7,65.96 JP21.8 69.88,66.14 72.36,66.14 JP21.7 72.54,66.14 74.85,66.14 JP22.8 75.03,66.14 77.34,66.14 JP22.7
N$80
  Top 0.406: SV5.10 67.39,68.63 69.7,68.63 JP21.10 69.88,68.63 72.36,68.63 JP21.9 72.54,68.63 74.85,68.63 JP22.10 75.03,68.63 77.34,68.63 JP22.9
N$81
  Top 0.406: SV5.12 JP21.12 JP21.11 JP22.12 JP22.11
N$82
  Top 0.406: SV5.14 67.39,73.61 69.7,73.61 JP21.14 69.88,73.61 72.19,73.61 JP21.13 72.54,73.79 74.85,73.79 JP22.14 75.03,73.79 77.34,73.79 JP22.13
N$83
  Top 0.406: SV5.16 67.39,76.28 69.7,76.28 JP21.16 69.88,76.28 72.36,76.28 JP21.15 72.54,76.28 74.85,76.28 JP22.16 75.03,76.28 77.34,76.28 JP22.15
N$84
  Top 0.406: JP24.2 49.61,38.23 51.92,38.23 JP24.1 52.27,38.05 54.41,38.05 JP23.2 54.76,38.23 57.07,38.23 JP23.1 57.25,38.05 59.56,38.05 SV6.1
N$85
  Top 0.406: JP24.4 49.61,40.72 51.92,40.72 JP24.3 52.09,40.72 54.59,40.72 JP23.4 54.76,40.72 57.07,40.72 JP23.3 57.25,40.72 59.56,40.72 SV6.3
N$86
  Top 0.406: SV6.5 59.56,43.2 57.25,43.2 JP23.5 57.07,43.2 54.76,43.2 JP23.6 54.59,43.2 52.27,43.2 JP24.5 51.92,43.2 49.61,43.2 JP24.6
N$87
  Top 0.406: JP24.8 49.61,45.87 51.92,45.87 JP24.7 52.09,45.87 54.59,45.87 JP23.8 54.76,45.87 57.07,45.87 JP23.7 57.25,45.7 59.56,45.7 SV6.7
N$88
  Top 0.406: JP24.10 49.61,48.36 51.92,48.36 JP24.9 52.09,48.36 54.59,48.36 JP23.10 54.76,48.36 57.07,48.36 JP23.9 57.25,48.18 59.56,48.18 SV6.9
N$89
  Top 0.406: JP24.12 49.61,50.85 51.92,50.85 JP24.11 52.09,50.85 54.59,50.85 JP23.12 54.76,50.85 57.07,50.85 JP23.11 57.25,50.85 59.56,50.85 SV6.11
N$90
  Top 0.406: JP24.14 JP24.13 JP23.14 JP23.13 SV6.13
N$91
  Top 0.406: JP24.16 49.61,56.01 51.92,56.01 JP24.15 52.27,55.83 54.41,55.83 JP23.16 54.76,56.01 57.07,56.01 JP23.15 57.25,55.83 59.56,55.83 SV6.15
N$92
  Top 0.406: SV6.2 67.39,38.05 69.7,38.05 JP25.2 69.88,38.05 72.19,38.05 JP25.1 72.54,38.23 74.85,38.23 JP26.2 75.03,38.23 77.34,38.23 JP26.1
N$93
  Top 0.406: SV6.4 67.39,40.72 69.7,40.72 JP25.4 69.88,40.72 72.36,40.72 JP25.3 72.54,40.72 74.85,40.72 JP26.4 75.03,40.72 77.34,40.72 JP26.3
N$94
  Top 0.406: JP26.5 77.34,43.2 75.03,43.2 JP26.6 74.85,43.2 72.54,43.2 JP25.5 72.36,43.2 70.05,43.2 JP25.6 69.7,43.2 67.39,43.2 SV6.6
N$95
  Top 0.406: SV6.8 67.39,45.7 69.7,45.7 JP25.8 70.05,45.7 72.36,45.7 JP25.7 72.54,45.87 74.85,45.87 JP26.8 75.03,45.87 77.34,45.87 JP26.7
N$96
  Top 0.406: SV6.10 67.39,48.18 69.7,48.18 JP25.10 69.88,48.36 72.36,48.36 JP25.9 72.54,48.36 74.85,48.36 JP26.10 75.03,48.36 77.34,48.36 JP26.9
N$97
  Top 0.406: SV6.12 67.39,50.85 69.7,50.85 JP25.12 69.88,50.85 72.36,50.85 JP25.11 72.54,50.85 74.85,50.85 JP26.12 75.03,50.85 77.34,50.85 JP26.11
N$98
  Top 0.406: SV6.14 JP25.14 JP25.13 JP26.14 JP26.13
N$99
  Top 0.406: SV6.16 67.39,55.83 69.7,55.83 JP25.16 69.88,55.83 72.19,55.83 JP25.15 72.54,56.01 74.85,56.01 JP26.16 75.03,56.01 77.34,56.01 JP26.15
N$100
  Top 0.406: JP37.1 2.67,20.45 2.67,22.76 J1.P$1
N$101
  Top 0.406: JP38.1 2.67,34.85 2.67,32.36 J1.P$2
N$102
  Top 0.406: JP41.1 2.67,2.67 2.67,4.98 J2.P$1
N$103
  Top 0.406: JP42.1 2.67,17.07 2.67,14.58 J2.P$2
N$104
  Top 0.406: JMP3.1 29.34,10.31 29.34,12.62 JMP1.2 29.34,12.8 29.34,15.11 JMP1.1
N$105
  Top 0.406: JMP3.3 JMP1.4 JMP1.3
N$106
  Top 0.406: JMP3.5 24.18,10.31 24.18,12.62 JMP1.6 24.18,12.8 24.18,15.11 JMP1.5
N$107
  Top 0.406: JMP3.7 21.69,10.31 21.69,12.62 JMP1.8 21.69,12.8 21.69,15.11 JMP1.7
N$108
  Top 0.406: JMP3.9 19.02,10.31 19.02,12.62 JMP1.10 19.02,12.8 19.02,15.11 JMP1.9
N$109
  Top 0.406: JMP3.11 16.54,10.31 16.54,12.62 JMP1.12 16.54,12.8 16.54,15.11 JMP1.11
N$110
  Top 0.406: JMP3.13 14.05,10.31 14.05,12.62 JMP1.14 14.05,12.8 14.05,15.11 JMP1.13
N$111
  Top 0.406: JMP3.15 11.56,10.31 11.56,12.62 JMP1.16 11.56,12.8 11.56,15.11 JMP1.15
N$112
  Top 0.406: JMP2.2 29.34,2.67 29.34,4.98 JMP2.1 29.34,5.16 29.34,7.47 JMP3.2
N$113
  Top 0.406: JMP2.4 JMP2.3 JMP3.4
N$114
  Top 0.406: JMP2.6 24.18,2.67 24.18,4.98 JMP2.5 24.18,5.16 24.18,7.47 JMP3.6
N$115
  Top 0.406: JMP2.8 21.69,2.67 21.69,4.98 JMP2.7 21.69,5.16 21.69,7.47 JMP3.8
N$116
  Top 0.406: JMP2.10 19.02,2.67 19.02,4.98 JMP2.9 19.02,5.16 19.02,7.47 JMP3.10
N$117
  Top 0.406: JMP2.12 16.54,2.67 16.54,4.98 JMP2.11 16.54,5.16 16.54,7.47 JMP3.12
N$118
  Top 0.406: JMP2.14 14.05,2.67 14.05,4.98 JMP2.13 14.05,5.16 14.05,7.47 JMP3.14
N$119
  Top 0.406: JMP2.16 11.56,2.67 11.56,4.98 JMP2.15 11.56,5.16 11.56,7.47 JMP3.16
N$120
  Top 0.406: JMP6.1 49.61,10.31 49.61,12.62 JMP4.2 49.61,12.8 49.61,15.11 JMP4.1
N$121
  Top 0.406: JMP6.3 47.12,10.31 47.12,12.62 JMP4.4 47.12,12.8 47.12,15.11 JMP4.3
N$122
  Top 0.406: JMP6.5 JMP4.6 JMP4.5
N$123
  Top 0.406: JMP6.7 41.96,10.31 41.96,12.62 JMP4.8 41.96,12.8 41.96,15.11 JMP4.7
N$124
  Top 0.406: JMP6.9 39.47,10.31 39.47,12.62 JMP4.10 39.47,12.8 39.47,15.11 JMP4.9
N$125
  Top 0.406: JMP6.11 36.8,10.31 36.8,12.62 JMP4.12 36.8,12.8 36.8,15.11 JMP4.11
N$126
  Top 0.406: JMP6.13 34.31,10.31 34.31,12.62 JMP4.14 34.31,12.8 34.31,15.11 JMP4.13
N$127
  Top 0.406: JMP6.15 31.83,10.31 31.83,12.62 JMP4.16 31.83,12.8 31.83,15.11 JMP4.15
N$128
  Top 0.406: JMP5.2 49.61,2.67 49.61,4.98 JMP5.1 49.61,5.16 49.61,7.47 JMP6.2
N$129
  Top 0.406: JMP5.4 47.12,2.67 47.12,4.98 JMP5.3 47.12,5.16 47.12,7.47 JMP6.4
N$130
  Top 0.406: JMP5.6 JMP5.5 JMP6.6
N$131
  Top 0.406: JMP5.8 41.96,2.67 41.96,4.98 JMP5.7 41.96,5.16 41.96,7.47 JMP6.8
N$132
  Top 0.406: JMP5.10 39.47,2.67 39.47,4.98 JMP5.9 39.47,5.16 39.47,7.47 JMP6.10
N$133
  Top 0.406: JMP5.12 36.8,2.67 36.8,4.98 JMP5.11 36.8,5.16 36.8,7.47 JMP6.12
N$134
  Top 0.406: JMP5.14 34.31,2.67 34.31,4.98 JMP5.13 34.31,5.16 34.31,7.47 JMP6.14
N$135
  Top 0.406: JMP5.16 31.83,2.67 31.83,4.98 JMP5.15 31.83,5.16 31.83,7.47 JMP6.16
N$136
  Top 0.406: JP31.1 24.18,20.45 26.67,20.45 JP28.2 26.85,20.45 29.16,20.45 JP28.1 29.34,20.45 31.65,20.45 JP27.2 31.83,20.45 34.14,20.45 JP27.1
N$137
  Top 0.406: JP31.3 24.18,22.94 26.67,22.94 JP28.4 26.85,22.94 29.16,22.94 JP28.3 29.34,22.94 31.65,22.94 JP27.4 31.83,22.94 34.14,22.94 JP27.3
N$138
  Top 0.406: JP31.5 24.18,25.43 26.67,25.43 JP28.6 26.85,25.43 29.16,25.43 JP28.5 29.34,25.43 31.65,25.43 JP27.6 31.83,25.43 34.14,25.43 JP27.5
N$139
  Top 0.406: JP31.7 24.18,28.09 26.67,28.09 JP28.8 26.85,28.09 29.16,28.09 JP28.7 29.34,28.09 31.65,28.09 JP27.8 31.83,28.09 34.14,28.09 JP27.7
N$140
  Top 0.406: JP31.9 24.18,30.58 26.67,30.58 JP28.10 26.85,30.58 29.16,30.58 JP28.9 29.34,30.58 31.65,30.58 JP27.10 31.83,30.58 34.14,30.58 JP27.9
N$141
  Top 0.406: JP31.11 24.18,33.07 26.67,33.07 JP28.12 26.85,33.07 29.16,33.07 JP28.11 29.34,33.07 31.65,33.07 JP27.12 31.83,33.07 34.14,33.07 JP27.11
N$142
  Top 0.406: JP31.13 JP28.14 JP28.13 JP27.14 JP27.13
N$143
  Top 0.406: JP33.2 49.61,28.09 51.92,28.09 JP33.1 52.09,28.09 54.59,28.09 JP32.2 54.76,28.09 57.07,28.09 JP32.1 57.25,27.91 59.56,27.91 IC1.8
N$144
  Top 0.406: JP33.4 49.61,30.58 51.92,30.58 JP33.3 52.09,30.58 54.59,30.58 JP32.4 54.76,30.58 57.07,30.58 JP32.3 57.25,30.4 59.56,30.4 IC1.7
N$145
  Top 0.406: JP33.6 49.61,33.07 51.92,33.07 JP33.5 52.09,33.07 54.59,33.07 JP32.6 54.76,33.07 57.07,33.07 JP32.5 57.25,33.07 59.56,33.07 IC1.6
N$146
  Top 0.406: JP33.8 JP33.7 JP32.8 JP32.7 IC1.5
N$147
  Top 0.406: JP43.1 6.4,2.67 6.4,4.98 J2.P$3
N$148
  Top 0.406: JP44.1 6.4,17.07 6.4,14.58 J2.P$4
N$149
  Top 0.406: JP40.1 6.4,34.85 6.4,32.36 J1.P$4
N$150
  Top 0.406: JP31.2 21.51,20.45 19.2,20.45 JP30.1 18.85,20.27 16.71,20.27 JP30.2 16.36,20.45 14.05,20.45 JP29.1 13.87,20.45 11.56,20.45 JP29.2
N$151
  Top 0.406: JP31.4 21.51,22.94 19.2,22.94 JP30.3 19.02,22.94 16.54,22.94 JP30.4 16.36,22.94 14.05,22.94 JP29.3 13.87,22.94 11.56,22.94 JP29.4
N$152
  Top 0.406: JP29.6 11.56,25.43 13.87,25.43 JP29.5 14.05,25.43 16.36,25.43 JP30.6 16.71,25.43 19.02,25.43 JP30.5 19.2,25.43 21.51,25.43 JP31.6
N$153
  Top 0.406: JP31.8 21.51,28.09 19.2,28.09 JP30.7 19.02,28.09 16.54,28.09 JP30.8 16.36,28.09 14.05,28.09 JP29.7 13.87,28.09 11.56,28.09 JP29.8
N$154
  Top 0.406: JP31.10 21.51,30.58 19.2,30.58 JP30.9 19.02,30.58 16.54,30.58 JP30.10 16.36,30.58 14.05,30.58 JP29.9 13.87,30.58 11.56,30.58 JP29.10
N$155
  Top 0.406: JP31.12 21.51,33.07 19.2,33.07 JP30.11 19.02,33.07 16.54,33.07 JP30.12 16.36,33.07 14.05,33.07 JP29.11 13.87,33.07 11.56,33.07 JP29.12
N$156
  Top 0.406: JP31.14 JP30.13 JP30.14 JP29.13 JP29.14
N$157
  Top 0.406: JP39.1 6.4,20.45 6.4,22.76 J1.P$3
N$158
  Top 0.406: IC1.1 67.39,27.91 69.7,27.91 JP34.2 70.05,27.91 72.36,27.91 JP34.1 72.54,28.09 74.85,28.09 JP35.2 75.03,28.09 77.34,28.09 JP35.1
N$159
  Top 0.406: IC1.2 67.39,30.4 69.7,30.4 JP34.4 69.88,30.58 72.36,30.58 JP34.3 72.54,30.58 74.85,30.58 JP35.4 75.03,30.58 77.34,30.58 JP35.3
N$160
  Top 0.406: IC1.3 67.39,33.07 69.7,33.07 JP34.6 69.88,33.07 72.36,33.07 JP34.5 72.54,33.07 74.85,33.07 JP35.6 75.03,33.07 77.34,33.07 JP35.5
N$161
  Top 0.406: IC1.4 JP34.8 JP34.7 JP35.8 JP35.7
N$165
  Top 0.406: PWR.12 63.48,3.91 63.48,6.22 PWR.11 63.3,6.22 62.94,6.22 58.67,10.49 JP8.5 58.5,10.31 58.5,12.62 JP8.6 58.5,12.8 58.5,15.11 JP10.5 58.5,15.29 58.5,17.78 JP10.6
N$166
  Top 0.406: PWR.16 58.5,3.91 58.5,6.22 PWR.15 58.32,6.4 57.25,6.4 53.52,10.13 JP8.1 JP8.2 JP10.1 JP10.2
N$169
  Top 0.406: PWR.14 60.98,3.91 60.98,6.22 PWR.13 60.81,6.4 60.27,6.4 56.19,10.49 JP8.3 56.01,10.31 56.01,12.62 JP8.4 56.01,12.8 56.01,15.11 JP10.3 56.01,15.29 56.01,17.78 JP10.4

### Text on the board
tNames: 0V | 0V | GT | CV | +5 | 0V
bNames: Prototype Board / rev01 - Nov 2021